# Altium schematic sheet Processor_Interface.SchDoc: Rechard Topping
size 431 x 279 mm; Date: 19-02-2023; ApprovedBy: Rechard Nabo; CheckedBy: Rechard Nabo; Author: Rechard Nabo; CompanyName: Rechard Nabo; DrawnBy: Rechard Nabo; Engineer: Rechard  Nabo; Organization: ORGANIZATION; Address1: ADDRESS 1; Address2: ADDRESS 2; Address3: ADDRESS 3; Address4: ADDRESS 4; Revision: -; SheetNumber: 1; SheetTotal: 5; ENG_APP_DATE: 19-02-2023; DSN_APP_DATE: 19-02-2023; CHK_APP_DATE: 19-02-2023; Time: 16:00
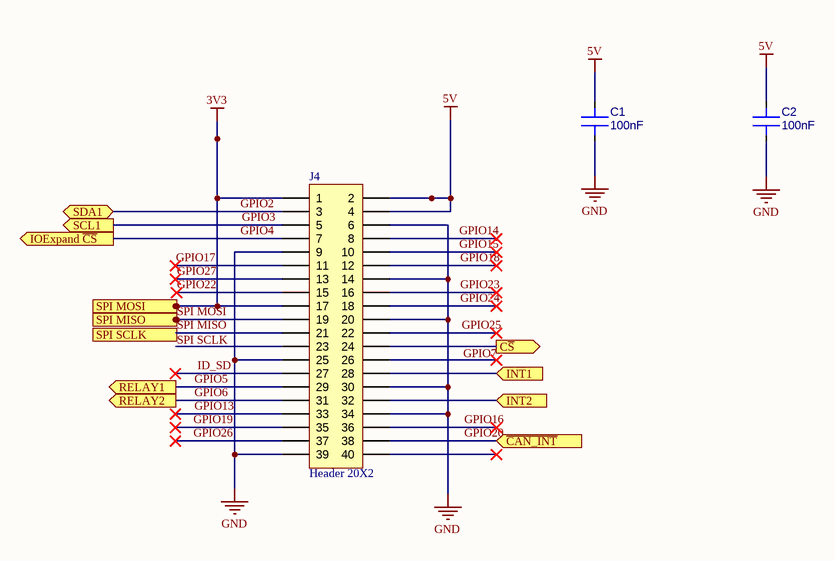
[diagram p0: Processor_Interface.SchDoc]

## Parts
C1  100nF  [ALTIUM_CHPC0603]
C2  100nF  [ALTIUM_CHPC0603]
J4  Header 20X2  [HDR2X20]

## Ports
C~{S} (out), INT1 (in), INT2 (in), IOExpand ~{CS} (out), RELAY1 (out), RELAY2 (out), SCL1 (out), SDA1 (bidir), SPI MISO (in), SPI MOSI (out), SPI SCLK (out), ~{CAN_INT} (in)

## Nets
3V3: J4.1 J4.17 ; port SPI MOSI
5V: C1.2 C2.2 J4.2 J4.4
GND: C1.1 C2.1 J4.6 J4.9 J4.14 J4.20 J4.25 J4.30 J4.34 J4.39
C~{S}: J4.24 ; port C~{S}
GPIO2: J4.3 ; port SDA1
GPIO3: J4.5 ; port SCL1
GPIO4: J4.7 ; port IOExpand ~{CS}
GPIO5: J4.29 ; port RELAY1
GPIO6: J4.31 ; port RELAY2
GPIO13: J4.33
GPIO14: J4.8
GPIO15: J4.10
GPIO16: J4.36
GPIO17: J4.11
GPIO18: J4.12
GPIO19: J4.35
GPIO20: J4.38 ; port ~{CAN_INT}
GPIO22: J4.15
GPIO23: J4.16
GPIO24: J4.18
GPIO25: J4.22
GPIO26: J4.37
GPIO27: J4.13
ID_SD: J4.27
INT1: J4.28 ; port INT1
INT2: J4.32 ; port INT2
SPI MISO: J4.21
SPI MOSI: J4.19 ; port SPI MISO

Not connected (* = marked no-connect by the designer): J4 23 26* 40*

## Notes on the sheet
- Labels drawn without touching a wire or pin: GPIO7, SPI SCLK
- DWG. NO.
- REV.
- SHT.
- THIS DOCUMENT AND THE DATA DISCLOSED HEREIN OR HEREWITH IS THE PROPERTY OF ALTIUM LIMITED AND MAY BE FREELY DISTRIBUTED IN WHOLE. NO RIGHTS ARE RESERVED OR EXPRESS OR IMPLIED WARANTEE GIVEN.
- REVISION
- DESCRIPTION
- DATE
- APPROVED
- ENG:
- APPROVALS
- PROJECT
- DSN:
- CHK:
- REFERENCE DOCUMENTS
- PROJECT REVISION:
- TITLE
- DOCUMENT REVISION:
- DESIGN ITEM:
- BOM:
- FAB DWG:
- PCB DWG:
- ASSY DWG:
- SCALE:
- SIZE
- B
- CAGE CODE
- FILE NAME
- DWG NO.
- SHEET
- OF
- REV

## Library data of the parts
C1 C2 = C0603_100n_±5%_25V_X7R: CAP; 100nF ±5% 25V CERAMIC CHIP X7R (0603); Manufacture Part Number: C0603C104C5GAC; Commodity No: 13 106 033; IC: L; UOM: PC; Drawn: MAKN; SMD: YES; PackageReference: 0603; HelpURL: \\pcb-server\altium libraries\datasheets\KEM_C1003_C0G_SMD.pdf; Dielectric: X7R; Tolerance: ±5%; Volts: 25V; LatestRevisionDate: 12-Dec-2013; ComponentLink1Description: Kemet Datasheet; ComponentLink1URL: \\PCB-Server\Altium Libraries\Datasheets\Capacitors\Kemet\KEM_C1003_C0G_SMD.pdf; ComponentLink2Description: Kemet Link; ComponentLink2URL: http://www.kemet.com/; Value: 100nF
J4 = Header 20X2: Header, 20-Pin, Dual row; LatestRevisionDate: 17-Jul-2002; LatestRevisionNote: Re-released for DXP Platform.; Publisher: Altium Limited